# Altium schematic sheet Cooling.SchDoc
size A4; DocumentNumber: 6; SheetNumber: 6; SheetTotal: 6
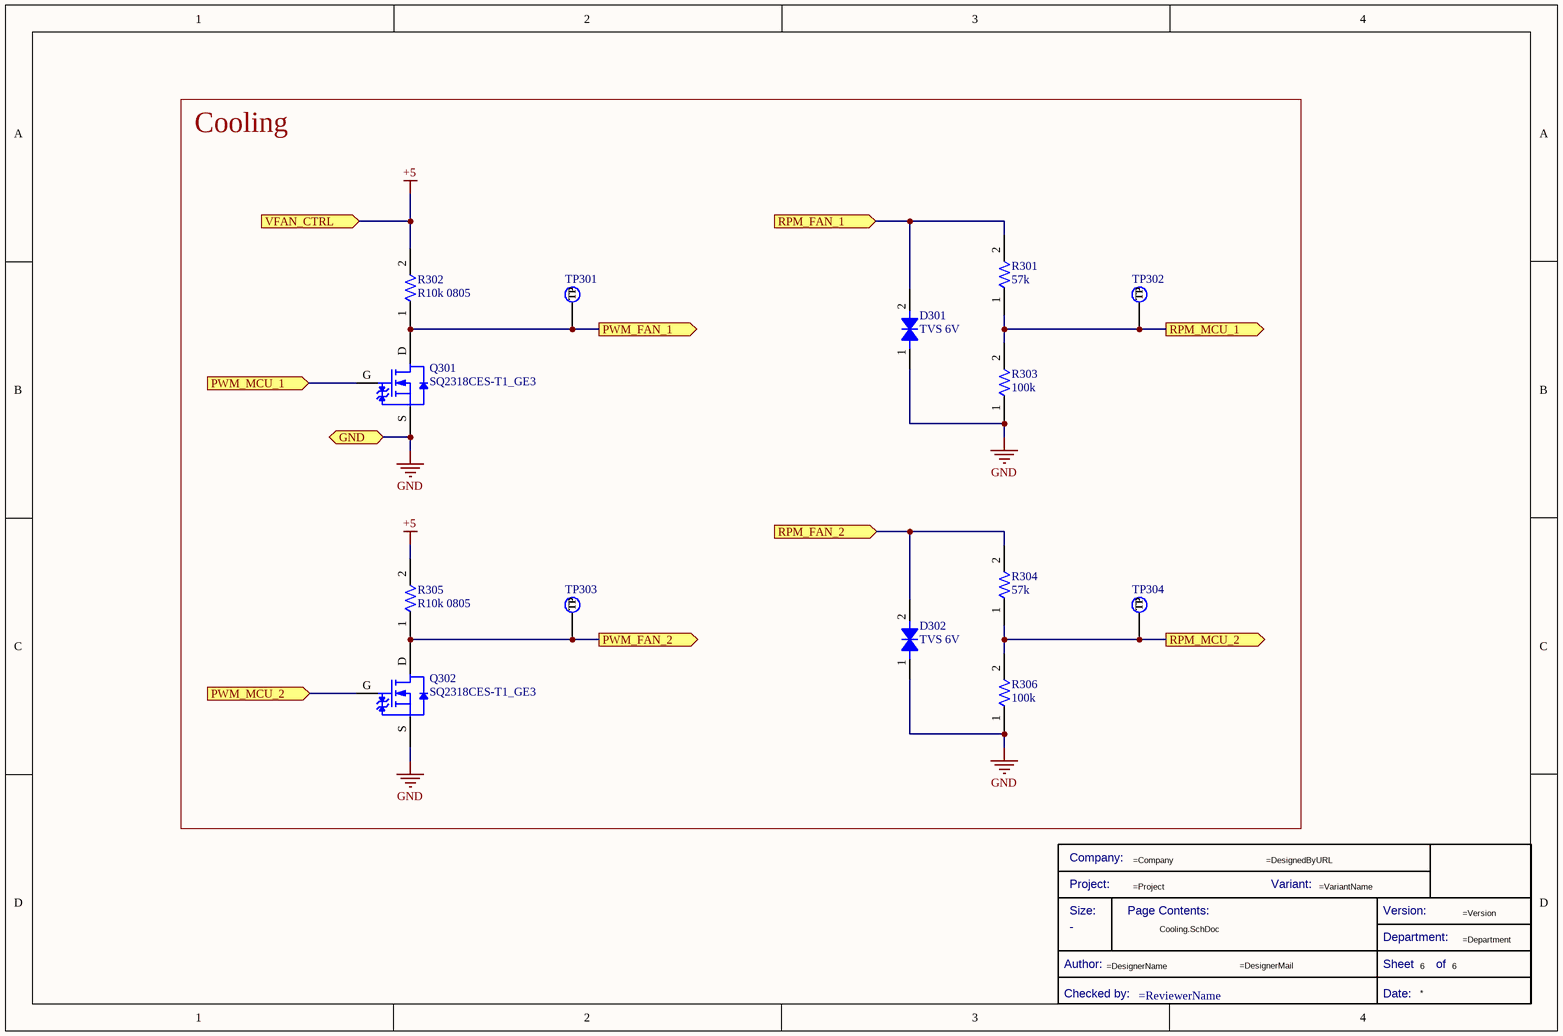
[diagram p0: Cooling.SchDoc]

## Parts
*  Title Block_template  (value not drawn)  (graphical)
D301  TVS 6V  [DTVS-DO-214AC]
D302  TVS 6V  [DTVS-DO-214AC]
Q301  SQ2318CES-T1_GE3  [SOT95P245X110-3N]
Q302  SQ2318CES-T1_GE3  [SOT95P245X110-3N]
R301  value 57k  [0805]  (hidden comment: R51k_0805)
R302  R10k 0805  [R0805FTK]
R303  value 100k  [RESC2013X70X40NL20T20]  (hidden comment: R100k-0805)
R304  value 57k  [0805]  (hidden comment: R51k_0805)
R305  R10k 0805  [R0805FTK]
R306  value 100k  [RESC2013X70X40NL20T20]  (hidden comment: R100k-0805)
TP301  TestPoint  [TestPoint]  (value not drawn)  (no BOM)
TP302  TestPoint  [TestPoint]  (value not drawn)  (no BOM)
TP303  TestPoint  [TestPoint]  (value not drawn)  (no BOM)
TP304  TestPoint  [TestPoint]  (value not drawn)  (no BOM)

## Blocks framed on the sheet
Cooling: D301 D302 Q301 Q302 R301-R306 TP301-TP304

## Ports
GND (bidir), PWM_FAN_1 (out), PWM_FAN_2 (out), PWM_MCU_1 (in), PWM_MCU_2 (in), RPM_FAN_1 (in), RPM_FAN_2 (in), RPM_MCU_1 (out), RPM_MCU_2 (out), VFAN_CTRL (in)

## Nets
+5: R302.2 R305.2 ; port VFAN_CTRL
GND: D301.1 D302.1 Q301.S Q302.S R303.1 R306.1 ; port GND
PWM_FAN_1: Q301.D R302.1 TP301.1(TP) ; port PWM_FAN_1
PWM_FAN_2: Q302.D R305.1 TP303.1(TP) ; port PWM_FAN_2
PWM_MCU_1: Q301.G ; port PWM_MCU_1
PWM_MCU_2: Q302.G ; port PWM_MCU_2
RPM_FAN_1: D301.2 R301.2 ; port RPM_FAN_1
RPM_FAN_2: D302.2 R304.2 ; port RPM_FAN_2
RPM_MCU_1: R301.1 R303.2 TP302.1(TP) ; port RPM_MCU_1
RPM_MCU_2: R304.1 R306.2 TP304.1(TP) ; port RPM_MCU_2

## Notes on the sheet
- (in symbol Title Block_template) Company:; Project:; Variant:; Size:; Page Contents:; Version:; Department:; Author:; Sheet; of; Checked by:; Date:

## Library data of the parts
* = Title Block_template: Standard Title Block; .Creator: GP; Category: Title Block; .PCBcheck: GP; .SCHcheck: GP; Checked by:: =ReviewerName; Size: -
D301 D302 = CMP-00154-1: TVS diode [Würth Elektronik] 824501600 TVS diode; Manufacturer: Wurth Electronics; Power Line Protection: No; Forward Voltage: 7.02V; Number of Bidirectional Channels: 1; Peak Pulse Current: 38.8A; .Creator: DO; Polarity: Bidirectional; Peak Pulse Power: 400W; Clamping Voltage: 10.3V; ComponentLink2Description: http://www.farnell.com/datasheets/2036401.pdf?src-supplier=Element14; Source: Filter components.SchLib; ComponentLink3URL: https://katalog.we-online.de/pbs/datasheet/824501600.pdf?src-supplier=Digi-Key; Mount: Surface Mount; Design Item ID: DTVS-6V-DO-214AC; ComponentLink3Description: https://katalog.we-online.de/pbs/datasheet/824501600.pdf?src-supplier=Digi-Key; RoHS: Yes; Resistor Type: Zener; REACH SVHC: Unknown; Pins: 2; Min Breakdown Voltage: 7.02V; Min Operating Temperature: -65°C; ComponentLink1URL: https://www.we-online.com/catalog/en/WE-TVSP?sq=824501600#824501600; Reverse Standoff Voltage: 6V; Stock 1: 780; Pricing 1: 1=0,28000, 10=0,26100, 50=0,26100, 100=0,23400, 500=0,20400, 1000=0,17400, 10000=0,17400 (USD); ComponentLink2URL: http://www.farnell.com/datasheets/2036401.pdf?src-supplier=Element14; Category: TVS Diodes; ComponentLink1Description: Where buy it; Manufacturer Part Number: 824501600; Packaging: Cut Tape; RoHS Compliant: Yes; Max Operating Temperature: 150°C
Q301 Q302 = CMP-013-00002-1: Mosfet, N-channel, 40V, 7A, SOT-23 Rohs Compliant: Yes
R301 R304 = CMP-009-00018-1: Fixed Resistor, Metal Glaze/thick Film, 0.125W, 51000ohm, 150V, 1% +/-Tol, 100ppm/Cel, Surface Mount, 0805. ERJ-6ENF5102V; Power: 125mW; Mounting Technology: Surface Mount; Pins: 2; Case/Package: 0805; RoHS Compliant: Yes; Tolerance: 1%; Min Operating Temperature: -55°C; Max Operating Temperature: 155°C
R302 R305 = CMP-00085-1: BOURNS         CR0805-JW-103ELF            Surface Mount Chip Resistor, Thick Film, CR Series, 10 kohm, 125 mW,  5%, 150 V; .Creator: DR; Power Rating: 125mW; Voltage Rating (DC): 100V; Voltage Rating: 150V; Temperature Coefficient: 200ppm/°C; Value: 10k; ComponentLink6URL: https://datasheet.ciiva.com/16783/70154685-16783482.pdf?src-supplier=Allied+Electronics; Manufacturer 1: Bourns; Package Quantity: 1; ComponentLink10URL: https://datasheet.ciiva.com/7985/1856384-7985869.pdf?src-supplier=Element14; Technology: THICK FILM; Source: Passives.SchLib; RoHS Compliant: Yes; ComponentLink10Description: https://datasheet.ciiva.com/7985/1856384-7985869.pdf?src-supplier=Element14; ComponentLink1URL: https://datasheet.ciiva.com/11821/0900766b80fcdb72-11821135.pdf?src-supplier=RSComponents; ComponentLink7Description: https://datasheet.ciiva.com/5548/chpreztr-5548491.pdf?src-supplier=Mouser; Radiation Hardening: No; Design Item ID: R10k-0805FTK; ComponentLink4Description: https://datasheet.ciiva.com/7986/691949-7986187.pdf?src-supplier=Element14; Pins: 2; ComponentLink9URL: https://datasheet.ciiva.com/6559/chpreztr-6559901.pdf?src-supplier=Digi-Key; Resistor Type: Thick Film; ComponentLink4URL: https://datasheet.ciiva.com/7986/691949-7986187.pdf?src-supplier=Element14; Contact Plating: Tin; Case Code (Metric): 2012; Military Standard: Not; Depth: 1.25mm; Case/Package: 0805; Packaging: Tape and Reel; ComponentLink9Description: https://datasheet.ciiva.com/6559/chpreztr-6559901.pdf?src-supplier=Digi-Key; Construction: Rectangular; Pricing 1: 1=0,05790, 10=0,01540, 25=0,01340, 100=0,00340 (USD); ComponentLink7URL: https://datasheet.ciiva.com/5548/chpreztr-5548491.pdf?src-supplier=Mouser; Category: Chip SMD Resistors; Length: 2mm; Max Operating Temperature: 155°C; Resistance Tolerance: 5%; Manufacturer Part Number 1: CR0805-JW-103ELF; Height: 0.5mm; ComponentLink2URL: https://datasheet.ciiva.com/9122/chpreztr-9122374.pdf?src-supplier=Avnet; Thickness: 508um; Max Power Dissipation: 125mW; ComponentLink8Description: https://datasheet.ciiva.com/6559/chpreztr-6559900.pdf?src-supplier=Digi-Key; REACH SVHC: No SVHC; ComponentLink8URL: https://datasheet.ciiva.com/6559/chpreztr-6559900.pdf?src-supplier=Digi-Key; ComponentLink5URL: https://datasheet.ciiva.com/30065/159chpreztr-30065976.pdf?src-supplier=Onlinecomponents.com; Width: 1.25mm; ComponentLink11URL: https://datasheet.ciiva.com/48692/001055517-da-01-en-smd-wid-cr0805-jw-103elf-10k-ohm-1-8w-48692118.pdf?src-supplier=Conrad; ComponentLink3Description: https://datasheet.ciiva.com/22693/1902866-22693254.pdf?src-supplier=Element14; ComponentLink11Description: https://datasheet.ciiva.com/48692/001055517-da-01-en-smd-wid-cr0805-jw-103elf-10k-ohm-1-8w-48692118.pdf?src-supplier=Conrad; ComponentLink1Description: https://datasheet.ciiva.com/11821/0900766b80fcdb72-11821135.pdf?src-supplier=RSComponents; ComponentLink2Description: https://datasheet.ciiva.com/9122/chpreztr-9122374.pdf?src-supplier=Avnet; Stock 1: 57566; Min Operating Temperature: -55°C; Series: CR0805; Number of Terminations: 2; Termination: SMD/SMT; Tolerance: 5%; Mount: Surface Mount; ComponentLink6Description: https://datasheet.ciiva.com/16783/70154685-16783482.pdf?src-supplier=Allied+Electronics; ComponentLink5Description: https://datasheet.ciiva.com/30065/159chpreztr-30065976.pdf?src-supplier=Onlinecomponents.com; RoHS: Yes; Features: Moisture Resistant; ComponentLink3URL: https://datasheet.ciiva.com/22693/1902866-22693254.pdf?src-supplier=Element14
R303 R306 = CMP-009-00003-2: Fixed Resistor, Metal Glaze/thick Film, 0.125W, 100000ohm, 150V, 5% +/-Tol, 200ppm/Cel, Surface Mount, 0805; Power: 125mW; Max Operating Temperature: 155°C; Mounting Technology: Surface Mount; RoHS Compliant: Yes; Min Operating Temperature: -55°C; Pins: 2; Case/Package: 0805; Tolerance: 5%
TP301-TP304 = CMP-00042-1: Test Point 1x1 mm; .SCHcheck: GP; Category: TestPoint; Source: e-Tech_Racing.SchLib; .Creator: GP; .PCBcheck: GP; Design Item ID: TestPoint